# EAGLE design ATtiny85 Starter (EAGLE 7.2.0)
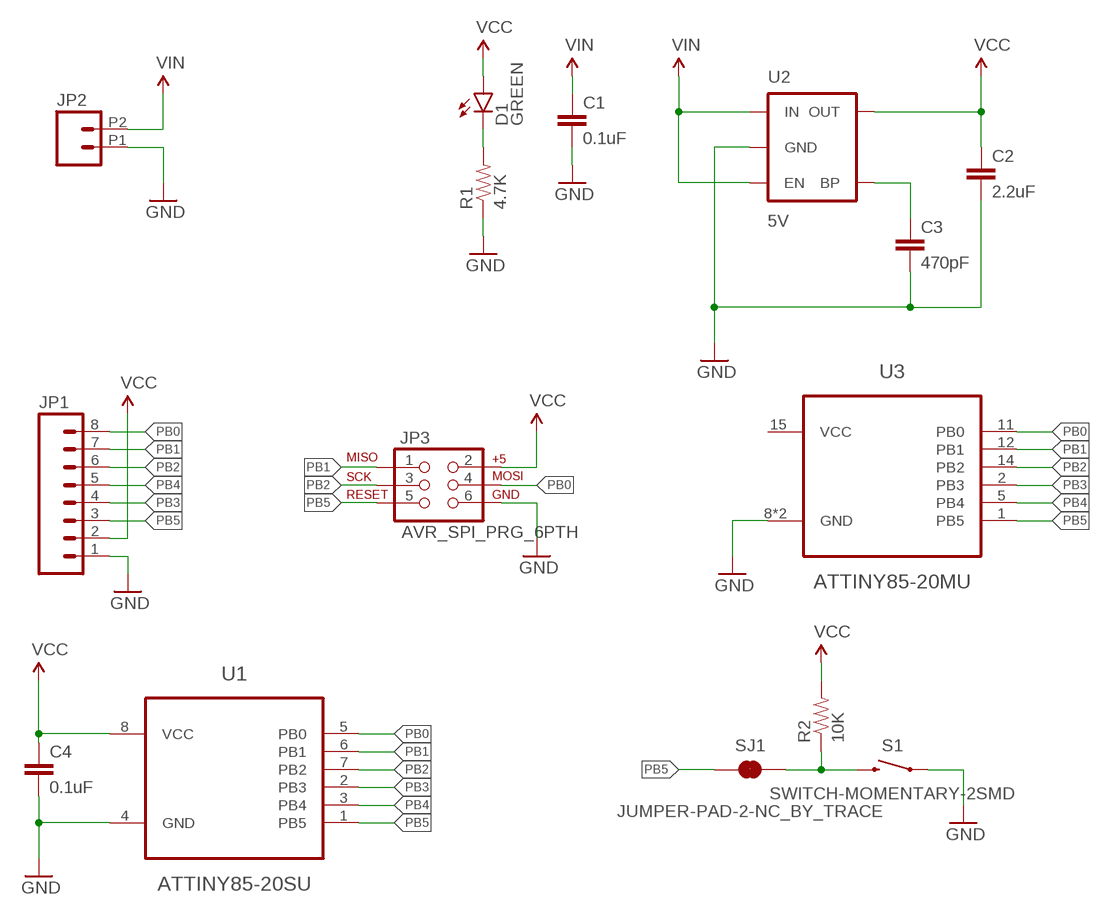
[diagram p0: schematic, sheet 1]

## Parts
C1  0.1uF  0.1UF-25V(+80/-20%)(0603)  [0603-CAP]
C2  2.2uF  2.2UF-10V-20%(0603)  [0603-CAP]
C3  470pF  470PF-50V-5%(0603)SMD  [0603-CAP]
C4  0.1uF  0.1UF-25V(+80/-20%)(0603)  [0603-CAP]
D1  GREEN  LED-GREEN0603  [LED-0603]
JP1  M08LOCK_NO_SILK  [1X08_LOCK_NO_SILK]
JP2  M022.54MM_SCREWTERM  [1X02_2.54_SCREWTERM]
JP3  AVR_SPI_PRG_6PTH  [2X3]
R1  4.7K  4.7KOHM-1/10W-1%(0603)  [0603-RES]
R2  10K  10KOHM-1/10W-1%(0603)0603  [0603-RES]
S1  SWITCH-MOMENTARY-2SMD  [TACTILE-SWITCH-SMD]
SJ1  JUMPER-PAD-2-NC_BY_TRACE  [PAD-JUMPER-2-NC_BY_TRACE_YES_SILK]
U1  ATTINY85-20SU  [8S2]
U2  5V  V_REG_MIC52055V  [SOT23-5]
U3  ATTINY85-20MU  [20M1]

## Nets
GND: C1.2 C2.2 C3.2 C4.2 JP1.1 JP2.P1 JP3.6 R1.1 S1.1 U1.4(GND) U2.2(GND) U3.8(GND) U3.PAD(GND)
N$1: R2.1 S1.3 SJ1.2
N$2: D1.C R1.2
N$3: C3.1 U2.4(BP)
PB0: JP1.8 JP3.4 U1.5(PB0) U3.11(PB0)
PB1: JP1.7 JP3.1 U1.6(PB1) U3.12(PB1)
PB2: JP1.6 JP3.3 U1.7(PB2) U3.14(PB2)
PB3: JP1.4 U1.2(PB3) U3.2(PB3)
PB4: JP1.5 U1.3(PB4) U3.5(PB4)
PB5: JP1.3 JP3.5 SJ1.1 U1.1(PB5) U3.1(PB5)
VCC: C2.1 C4.1 D1.A JP1.2 JP3.2 R2.2 U1.8(VCC) U2.5(OUT)
VIN: C1.1 JP2.P2 U2.1(IN) U2.3(EN)

## Power pins joined to a net without a drawn wire
VCC: U3.15(VCC)

## Library data of the parts
C1 C4 = SparkFun-Capacitors:0.1UF-25V(+80/-20%)(0603): CAP-00810 Ceramic Standard decoupling cap; PROD_ID: CAP-00810
C2 = SparkFun-Capacitors:2.2UF-10V-20%(0603): CAP-07888; PROD_ID: CAP-07888
C3 = SparkFun-Capacitors:470PF-50V-5%(0603): CAP-07884; PROD_ID: CAP-07884
D1 = SparkFun-LED:LED-GREEN: Various green LEDs Green LEDs used in SFE Production 0603- DIO-00821 LARGE- DIO-00862 LILYPAD- DIO-09910; PROD_ID: DIO-00821
JP1 = SparkFun-Connectors:M08: Header 8 Standard 8-pin 0.1" header. Use with straight break away headers (SKU : PRT-00116), right angle break away headers (PRT-00553), swiss pins (PRT-00743), machine pins (PRT-00117), and female headers (PRT-00115).
JP2 = SparkFun-Connectors:M02: Standard 2-pin 0.1" header. Use with - straight break away headers ( PRT-00116) - right angle break away headers (PRT-00553) - swiss pins (PRT-00743) - machine pins (PRT-00117) - female headers (PRT-00115) Molex polarized connector foot print use with: PRT-08233 with associated crimp pins and housings. 2.54_SCREWTERM for use with PRT-10571. 3.5mm Screw Terminal footprints for PRT-08084 5mm Screw Terminal footprints for use with PRT-08432
JP3 = SparkFun-Connectors:AVR_SPI_PRG_6: AVR ISP 6 Pin This is the reduced ISP connector for AVR programming. Common on Arduino. This footprint will take up less PCB space and can be used with a 10-pin to 6-pin adapter such as SKU: BOB-08508 **Special note about "TEST_POINT" package. The stop mask is on the top side, so if you want your programming test points to be on the bottom of your board, make sure to place this package on the bottom side of the board. This also ensure that the orientation to program from the bottom side will be correct.
R1 = SparkFun-Resistors:4.7KOHM-1/10W-1%(0603): RES-07857; PROD_ID: RES-07857
R2 = SparkFun-Resistors:10KOHM-1/10W-1%(0603): RES-00824; PROD_ID: RES-00824
S1 = SparkFun-Electromechanical:SWITCH-MOMENTARY-2: Various NO switches- pushbuttons, reed, etc; PROD_ID: SWCH-08247
SJ1 = SparkFun-Passives:JUMPER-PAD-2-NC_BY_TRACE
U1 U3 = Atmel_AVR8:ATTINY85: Atmel 8-bit AVR Microcontroller with 8K Bytes In-System Programmable Flash Features High Performance, Low Power AVR® 8-Bit Microcontroller Advanced RISC Architecture 120 Powerful Instructions – Most Single Clock Cycle Execution 32 x 8 General Purpose Working Registers Fully Static Operation Non-volatile Program and Data Memories 8K Bytes of In-System Programmable Program Memory Flash Endurance: 10,000 Write/Erase Cycles 512 Bytes In-System Programmable EEPROM Endurance: 100,000 Write/Erase Cycles 512 Bytes Internal SRAM Programming Lock for Self-Programming Flash Program and EEPROM Data Security
U2 = SparkFun-PowerIC:V_REG_MIC5205: V_REG MIC5205 Standard 3.3V, 5V, and Adjustable 150mA LDO voltage regulator in SOT-23 layout. Micrel part MIC5205. BP (by-pass) pin is used to lower output noise with 470pF cap, may be left open. On the adjustable version BP is used to set output.; PROD_ID: VREG-00823

## Board
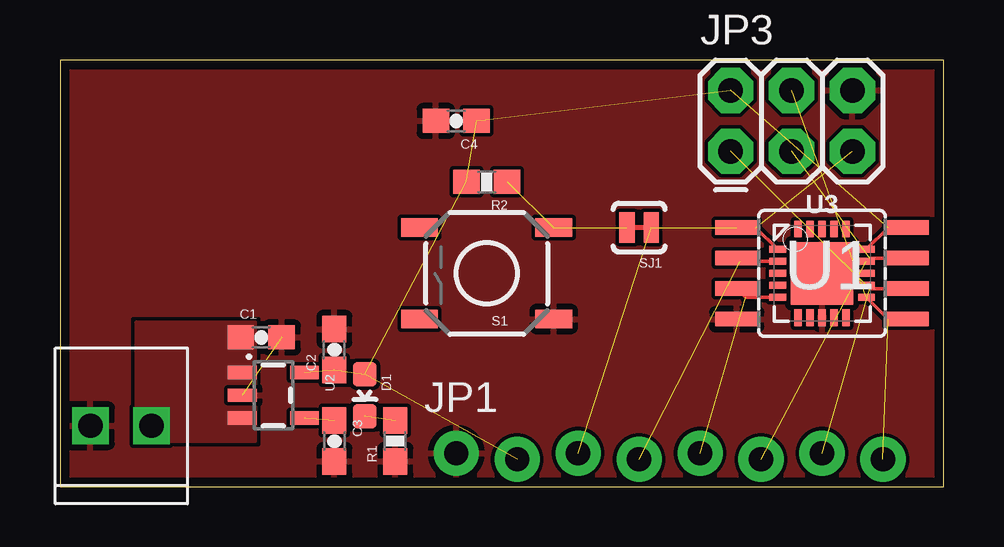
[diagram p1: board, top side]

Size 36.83 x 17.78 mm. Coordinates in mm from the lower left corner, seen from the top.
Outline: 0,0 36.83,0 36.83,17.78 0,17.78 0,0
Copper layers (1*16): Top 0.0356mm / dielectric 1.5011mm / Bottom 0.0356mm
Design rules "oshpark-2layer": minimum track width 6mil, minimum drill 13mil, track to track 6mil, track to pad 6mil, pad to pad 6mil, via to via 6mil, smd to smd 6mil, copper to edge 15mil, drill to drill 6mil, minimum pad ring 7mil, minimum via ring 7mil, stop-mask expansion 4mil, vias tented up to drill 0mil, thermal gap 10mil

### Footprints (pad centres in the part's own frame; a part is rotated, then mirrored left to right if it is on the bottom)
0603-CAP = smd 1.1 x 1: 1 -0.85,0; 2 0.85,0
LED-0603 = smd 1 x 1: A 0,-0.877; C 0,0.877
1X08_LOCK_NO_SILK = drill 1.016 pad 1.88: 1 0,0.127; 2 2.54,-0.127; 3 5.08,0.127; 4 7.62,-0.127; 5 10.16,0.127; 6 12.7,-0.127; 7 15.24,0.127; 8 17.78,-0.127
1X02_2.54_SCREWTERM = drill 1.016 square: P1 2.54,0; P2 0,0
2X3 = drill 1.016 pad 1.88 octagon: 1 0,0; 2 0,2.54; 3 2.54,0; 4 2.54,2.54; 5 5.08,0; 6 5.08,2.54
0603-RES = smd 1.1 x 1: 1 -0.85,0; 2 0.85,0
TACTILE-SWITCH-SMD = smd 1.524 x 0.762: 1 -2.794,1.905; 2 2.794,1.905; 3 -2.794,-1.905; 4 2.794,-1.905
PAD-JUMPER-2-NC_BY_TRACE_YES_SILK = smd 0.635 x 1.27: 1 -0.508,0; 2 0.508,0
8S2 = smd 1.8 x 0.6: 1 -3.55,1.905; 2 -3.55,0.635; 3 -3.55,-0.635; 4 -3.55,-1.905; 5 3.55,-1.905; 6 3.55,-0.635; 7 3.55,0.635; 8 3.55,1.905
SOT23-5 = smd 0.55 x 1.2: 1 -0.95,-1.3; 2 0,-1.3; 3 0.95,-1.3; 4 0.95,1.3; 5 -0.95,1.3
20M1 = smd 0.7 x 0.3: 1 -1.85,1; 2 -1.85,0.5; 3 -1.85,0; 4 -1.85,-0.5; 5 -1.85,-1; 11 1.85,-1; 12 1.85,-0.5; 13 1.85,0; 14 1.85,0.5; 15 1.85,1 | smd 0.3 x 0.7: 6 -1,-1.85; 7 -0.5,-1.85; 8 0,-1.85; 9 0.5,-1.85; 10 1,-1.85; 16 1,1.85; 17 0.5,1.85; 18 0,1.85; 19 -0.5,1.85; 20 -1,1.85 | smd 2.6 x 2.6: PAD 0,0

### Placement (x,y rotation side)
C1  8.38,6.22 0 top
C2  11.43,5.71 90 top
C3  11.43,1.91 270 top
C4  16.51,15.24 180 top
D1  12.7,3.81 180 top
JP1  16.51,1.27 0 top
JP2  3.81,2.54 180 top
JP3  27.94,13.97 0 top
R1  13.97,1.91 90 top
R2  17.78,12.7 180 top
S1  17.78,8.89 180 top
SJ1  24.13,10.79 180 top
U1  31.75,8.89 0 top
U2  8.89,3.81 270 top
U3  31.75,8.89 0 top

### Tracks (layer width: path | path; a pad name or v marks a point on that pad's centre or on a via)
GND  (1 unrouted)
  pour Top (rank 2): 0,0 36.83,0 36.83,17.78 0,17.78
N$1  (2 unrouted)
N$2  (1 unrouted)
N$3  (1 unrouted)
PB0  (2 unrouted)
  Top 0.152: U1.5 34.51,6.99 U3.11
PB1  (2 unrouted)
  Top 0.152: U1.6 33.73,8.26 U3.12
PB2  (2 unrouted)
  Top 0.152: U1.7 33.73,9.53 U3.14
PB3  (1 unrouted)
  Top 0.152: U3.2 28.34,9.39 U1.2
PB4  (1 unrouted)
  Top 0.152: U3.5 28.57,7.89 U1.3
PB5  (3 unrouted)
  Top 0.152: U1.1 29,10.79 U3.1
VCC  (7 unrouted)
  Top 0.152: U1.8 34.51,10.79 U3.15
VIN
  pour Top (no thermals): 8.13,1.91 8.13,6.86 3.17,6.86 3.17,1.91